# EAGLE design VoltageControl_V1p1 (EAGLE 9.6.2)
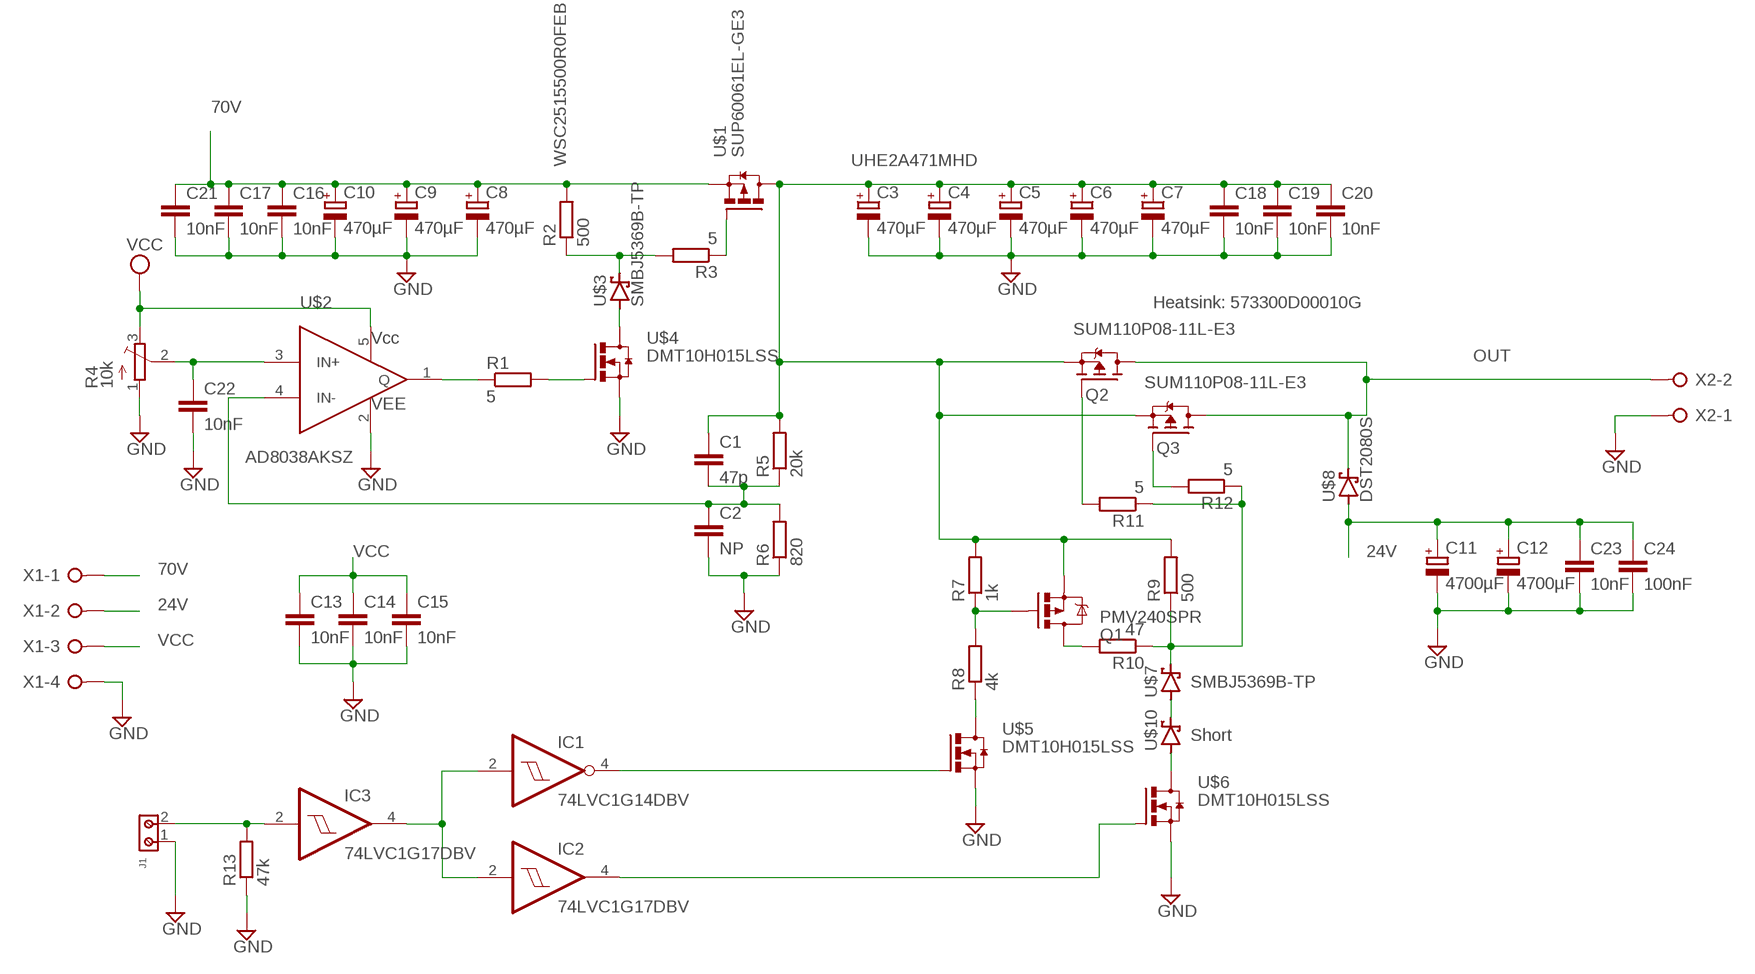
[diagram p0: schematic, sheet 1]

## Parts
C1  47p  C-EUC0805  [C0805]
C2  NP  C-EUC0805  [C0805]
C3  470µF  CPOL-EUE7.5-16  [E7,5-16]
C4  470µF  CPOL-EUE7.5-16  [E7,5-16]
C5  470µF  CPOL-EUE7.5-16  [E7,5-16]
C6  470µF  CPOL-EUE7.5-16  [E7,5-16]
C7  470µF  CPOL-EUE7.5-16  [E7,5-16]
C8  470µF  CPOL-EUE7.5-16  [E7,5-16]
C9  470µF  CPOL-EUE7.5-16  [E7,5-16]
C10  470µF  CPOL-EUE7.5-16  [E7,5-16]
C11  4700µF  CPOL-EUE7.5-18  [E7,5-18]
C12  4700µF  CPOL-EUE7.5-18  [E7,5-18]
C13  10nF  C-EUC0805  [C0805]
C14  10nF  C-EUC0805  [C0805]
C15  10nF  C-EUC0805  [C0805]
C16  10nF  C-EUC0805  [C0805]
C17  10nF  C-EUC0805  [C0805]
C18  10nF  C-EUC0805  [C0805]
C19  10nF  C-EUC0805  [C0805]
C20  10nF  C-EUC0805  [C0805]
C21  10nF  C-EUC0805  [C0805]
C22  10nF  C-EUC0805  [C0805]
C23  10nF  C-EUC1206  [C1206]
C24  100nF  C-EUC1206  [C1206]
IC1  74LVC1G14DBV  [SOT23-5]
IC2  74LVC1G17DBV  [SOT23-5]
IC3  74LVC1G17DBV  [SOT23-5]
J1  691210910002  [691210910002]
Q1  PMV240SPR  MOSFET-PCHANNEL  [SOT23-3]
Q2  SUM110P08-11L-E3  SPB80P06P  [TO263]
Q3  SUM110P08-11L-E3  SPB80P06P  [TO263]
R1  5  R-EU_R0805  [R0805]
R2  500  R-EU_R2512  [R2512]
R3  5  R-EU_R0805  [R0805]
R4  10k  TRIM_EU-SM-42/43X  [SM-42/43X]
R5  20k  R-EU_R0805  [R0805]
R6  820  R-EU_R0805  [R0805]
R7  1k  R-EU_R2512  [R2512]
R8  4k  R-EU_R2512  [R2512]
R9  500  R-EU_R2512  [R2512]
R10  47  R-EU_R0805  [R0805]
R11  5  R-EU_R0805  [R0805]
R12  5  R-EU_R0805  [R0805]
R13  47k  R-EU_R0805  [R0805]
U$1  SUP60061EL-GE3  MOSFET_SUNK  [TO220BH]
U$2  AD8038AKSZ  [SC70-5]
U$3  SMBJ5369B-TP  SCHOTTKYDO-214-AA  [DO-214AA]
U$4  DMT10H015LSS  [SOIC8]
U$5  DMT10H015LSS  [SOIC8]
U$6  DMT10H015LSS  [SOIC8]
U$7  SMBJ5369B-TP  SCHOTTKYDO-214-AA  [DO-214AA]
U$8  DST2080S  [TO-277B]
U$10  Short  SCHOTTKYDO-214-AA  [DO-214AA]
X1  W237-04P  [W237-4P]
X2  W237-02P  [W237-132]

## Nets
24V: C11.+ C12.+ C23.1 C24.1 U$8.P$2(A) U$8.P$3(A) X1.2
70V: C8.+ C9.+ C10.+ C16.1 C17.1 C21.1 R2.2 U$1.P$3(S) X1.1
GND: C2.2 C3.- C4.- C5.- C6.- C7.- C8.- C9.- C10.- C11.- C12.- C13.2 C14.2 C15.2 C16.2 C17.2 C18.2 C19.2 C20.2 C21.2 C22.2 C23.2 C24.2 J1.1 R4.1(A) R6.1 R13.1 U$2.2(VEE) U$4.1(S) U$4.2(S) U$4.3(S) U$5.1(S) U$5.2(S) U$5.3(S) U$6.1(S) U$6.2(S) U$6.3(S) X1.4 X2.1
N$1: R1.1 U$2.1(Q)
N$2: R1.2 U$4.4(G)
N$3: U$3.A U$4.5(D) U$4.6(D) U$4.7(D) U$4.8(D)
N$4: R2.1 R3.2 U$3.C
N$5: R3.1 U$1.P$1(G)
N$6: U$7.A U$10.C
N$7: C22.1 R4.2(S) U$2.3(IN+)
N$8: C1.2 C2.1 R5.1 R6.2 U$2.4(IN-)
N$9: Q1.1(G) R7.1 R8.2
N$10: C1.1 C3.+ C4.+ C5.+ C6.+ C7.+ C18.1 C19.1 C20.1 Q1.2(S) Q2.2(S) Q3.2(S) R5.2 R7.2 R9.2 U$1.P$2(D)
N$11: IC2.4(O) U$6.4(G)
N$12: R8.1 U$5.5(D) U$5.6(D) U$5.7(D) U$5.8(D)
N$13: U$6.5(D) U$6.6(D) U$6.7(D) U$6.8(D) U$10.A
N$14: R9.1 R10.1 R11.1 R12.1 U$7.C
N$15: Q1.3(D) R10.2
N$17: Q2.1(G) R11.2
N$18: Q3.1(G) R12.2
N$20: IC1.2(I) IC2.2(I) IC3.4(O)
N$21: IC1.4(O) U$5.4(G)
N$22: IC3.2(I) J1.2 R13.2
OUT: Q2.3(D) Q3.3(D) U$8.P$1(C) X2.2
VCC: C13.1 C14.1 C15.1 R4.3(E) U$2.5(VCC) X1.3

## Notes on the sheet
- WSC2515500R0FEB | UHE2A471MHD
- Heatsink: 573300D00010G

## Power pins joined to a net without a drawn wire
GND: IC1.3(GND) IC2.3(GND) IC3.3(GND)
VCC: IC1.5(VCC) IC2.5(VCC) IC3.5(VCC)

## Library data of the parts
C1 C2 C13-C24 = rcl:C-EU: CAPACITOR, European symbol; SPICEPREFIX: C
C3-C12 = rcl:CPOL-EU: POLARIZED CAPACITOR, European symbol; SPICEPREFIX: C
IC1 = 74xx-little-us:74*1G14: Single Schmitt-Trigger Inverter Gate
IC2 IC3 = 74xx-little-us:74*1G17: Single Schmitt-Trigger Buffer
J1 = Wurth_Connectors_WR-TBL Rising Cage Clamp:691210910002: WR-TBL Serie 2109 - 2.54 mm Horiz. Entry KIND PROPERTIES Pitch 2.54 mm MATERIAL PROPERTIES Insulator Material PA66 Insulator Flammability Rating UL94 V-0 Insulator Color Green Contact Material Brass Contact Plating Copper over Zinc Terminal Screw Material Steel Terminal Screw Plating Zinc Wire Guard Material Brass GENERAL INFORMATION Operating Temperature -40 up to +105 °C Compliance Lead free / RoHS ELECTRICAL PROPERTIES IR cULus 6 A Working Voltage [cULus] 150 V (AC) Withstanding Voltage [cULus] 1300 V (AC) Contact Resistance [cULus] 20 mΩ MECHANICAL PROPERTIES Wire Strip Length 4 up to 5 (mm) Screw M1.6 Solid Wire Section (AWG) 30 to 18 (AWG) Solid Wire Section (Metric) 0.0509 to 0.823 (mm²) Stranded Wire Section (AWG) 30 to 18 (AWG) Stranded Wire Section (Metric) 0.0509 to 0.823 (mm²) CERTIFICATION cULus Approval E315414 PACKAGING PROPERTIES Packaging Box <https://katalog.we-online.com/media/images/v2/o33231v209%20Family_WR-TBL_69121091000x.jpg> Details see: https://katalog.we-online.com/en/em/TBL_2_54_2109_HORIZONTAL_ENTRY_69121091000X Updated by Ella Wu 2019-11-12 2019(C) Wurth Elektronik; DATASHEET-URL: https://www.we-online.com/catalog/datasheet/691210910002.pdf; IR-UL: 6A; MOUNT: THT; PART-NUMBER: 691210910002; PINS: 2; PITCH: 2.54mm; TYPE: Horizontal; WIRE: 30 to 18 (AWG) 0.0509 to 0.823 (mm²); WORKING-VOLTAGE-UL: 150V (AC)
Q1 = User-Submitted:MOSFET-PCHANNEL: Generic PMOSFET IRLML2244 - TRANS-11153 (SOT-23 -20V -4.3A) (1.Gate 2.Source 3.Drain) FQP27P06 - COM-10349 <http://www.sparkfun.com/products/10349> (TO-220 -60V -27A) (1.Gate 2.Source 3.Drain); PROD_ID: TRANS-08285
Q2 Q3 = transistor-fet:SPB80P06P: SIPMOS (R) Power-Transistor P-Channel, Enhancement mode Source: http://www.infineon.com/upload/Document/cmc_upload/documents/011/3685/SPP80P06P.pdf
R1-R3 R5-R13 = rcl:R-EU_: RESISTOR, European symbol; SPICEPREFIX: R
R4 = pot:TRIM_EU-: POTENTIOMETER
U$1 = Orzada:MOSFET_SUNK
U$2 = Orzada:AD8038
U$3 U$7 U$10 = Orzada:SCHOTTKY
U$4-U$6 = Orzada:DMT10H015LSS
U$8 = Orzada:DST2080S: Schottky Diode TO-277B
X1 = con-wago-508:W237-04P: WAGO SREW CLAMP; OC_FARNELL: unknown; OC_NEWARK: unknown
X2 = con-wago-508:W237-02P: WAGO SREW CLAMP; OC_FARNELL: unknown; OC_NEWARK: unknown

## Board
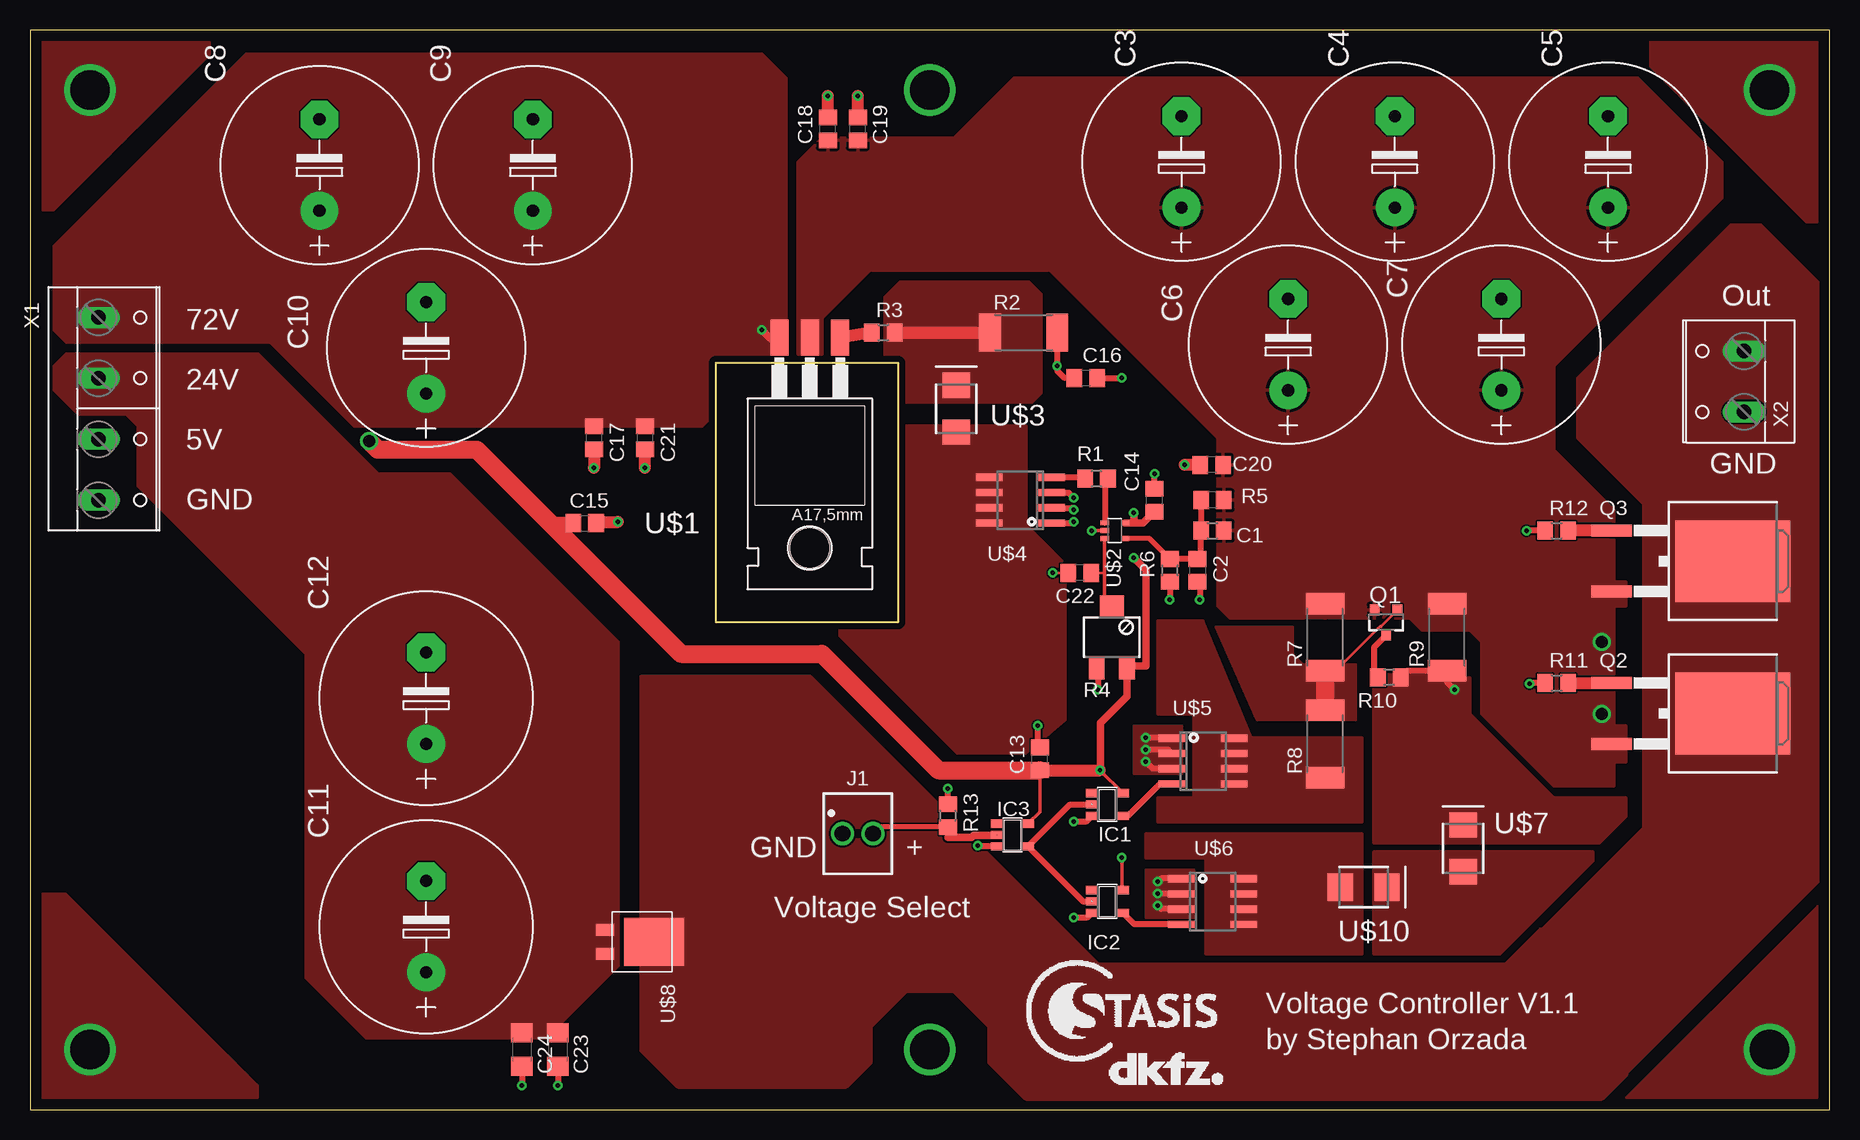
[diagram p1: board, top side]
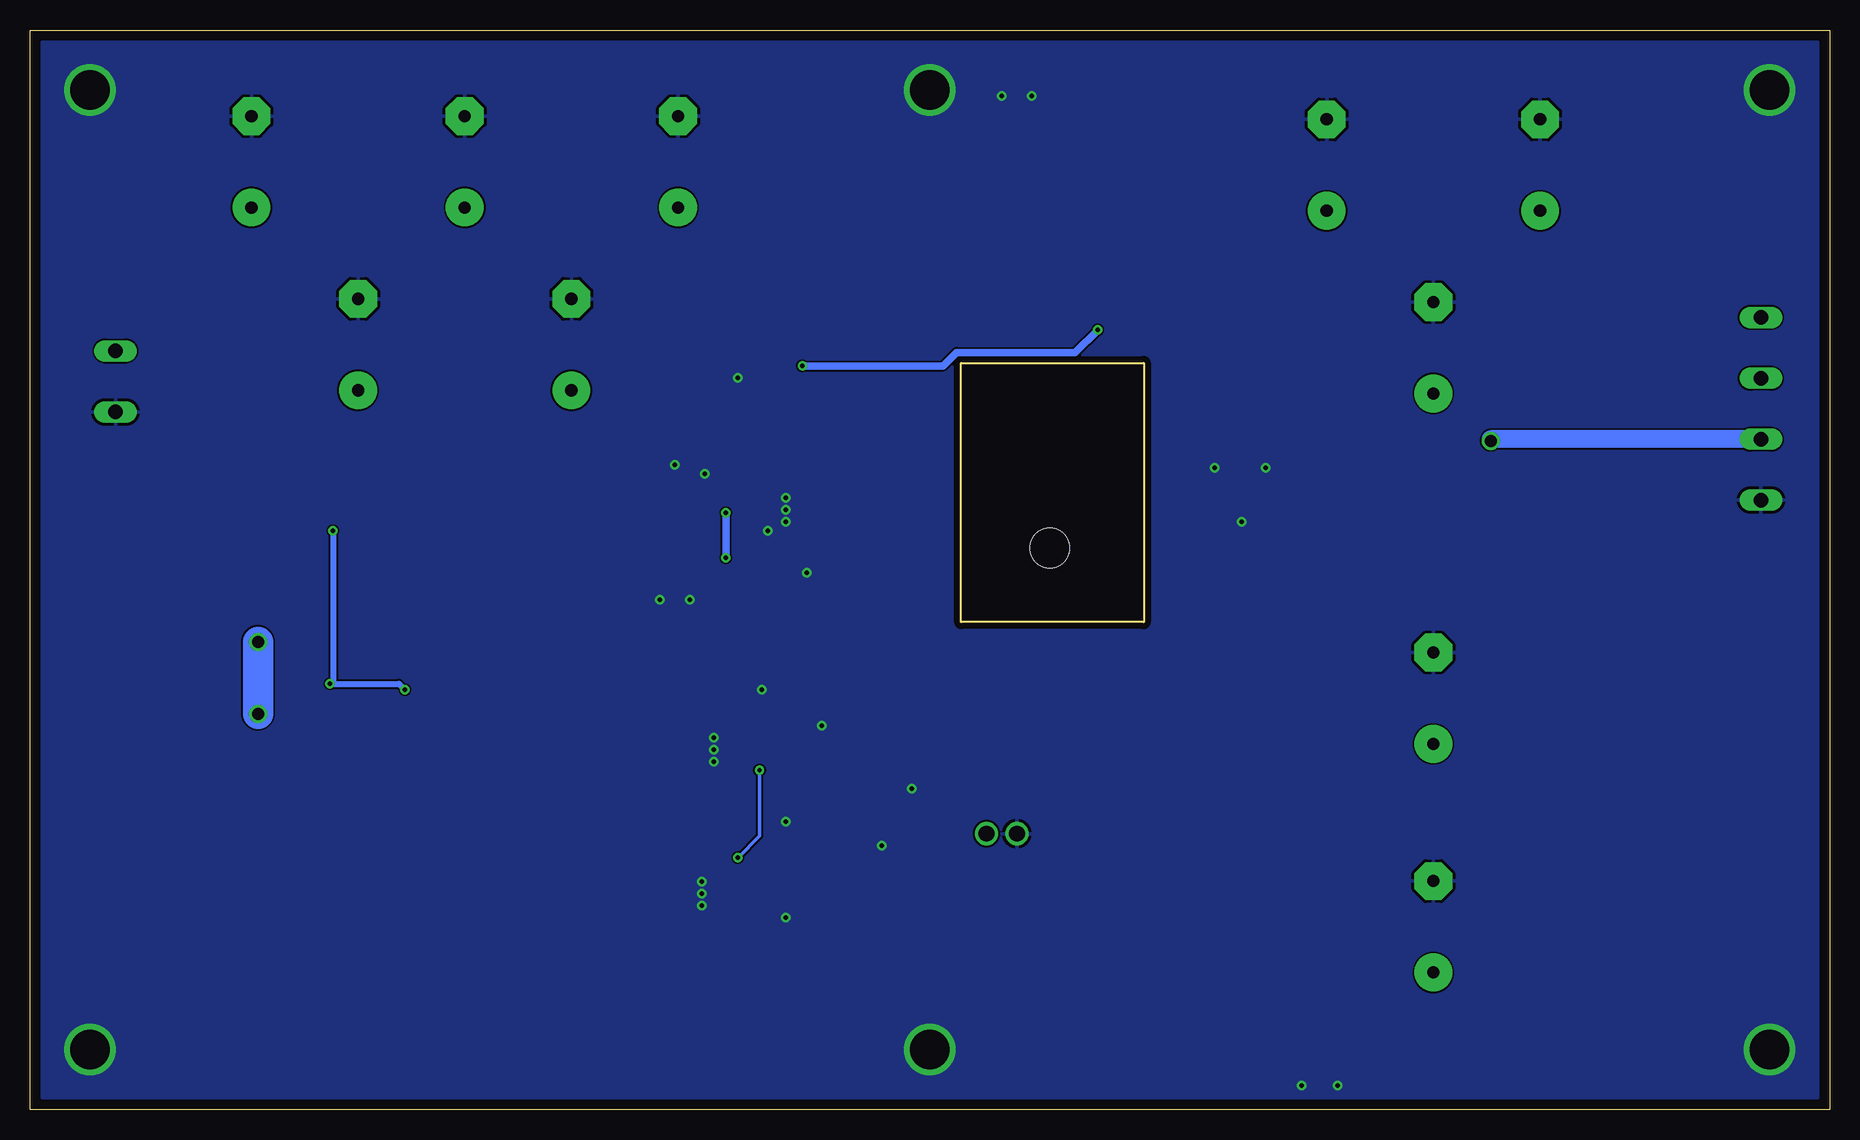
[diagram p2: board, bottom side, seen from below]

Size 150 x 90 mm. Coordinates in mm from the lower left corner, seen from the top.
Outline: 0,0 150,0 150,90 0,90 0,0
Outline: 57.15,62.23 57.15,40.64 72.39,40.64 72.39,62.23 57.15,62.23
Copper layers (1*16): Top 0.035mm / dielectric 1.5mm / Bottom 0.035mm
Design rules "default *": minimum track width 6mil, minimum drill 0.35mm, track to track 6mil, track to pad 6mil, pad to pad 6mil, via to via 6mil, smd to smd 6mil, copper to edge 20mil, drill to drill 6mil, minimum pad ring 10mil, minimum via ring 8mil, stop-mask expansion 4mil, vias tented up to drill 0mil, thermal gap 10mil

### Footprints (pad centres in the part's own frame; a part is rotated, then mirrored left to right if it is on the bottom)
C0805 = smd 1.3 x 1.5: 1 -0.95,0; 2 0.95,0
E7,5-16 = drill 1.016 pad 3.15: + -3.81,0 | drill 1.016 pad 3.15 octagon: - 3.81,0
E7,5-18 = drill 1.016 pad 3.15: + -3.81,0 | drill 1.016 pad 3.15 octagon: - 3.81,0
C1206 = smd 1.6 x 1.8: 1 -1.4,0; 2 1.4,0
SOT23-5 = smd 0.69 x 0.99: 1 -0.95,-1.29; 2 0,-1.29; 3 0.95,-1.29; 4 0.95,1.3; 5 -0.95,1.3
691210910002 = drill 1.3: 1 -1.27,0; 2 1.27,0
SOT23-3 = smd 0.8 x 0.9: 1 -0.95,-1; 2 0.95,-1; 3 0,1.1
TO263 = smd 1 x 3.4: 1 -2.54,-6.6; 2 2.54,-6.6 | smd 6.8 x 9.6: 3 0,3.5
R0805 = smd 1.3 x 1.5: 1 -0.95,0; 2 0.95,0
R2512 = smd 1.8 x 3.2: 1 -2.8,0; 2 2.8,0
SM-42/43X = smd 1.3 x 1.9: 1 -1.27,-2.55; 3 1.27,-2.55 | smd 2 x 1.9: 2 0,2.55
TO220BH = smd 1.5 x 3: P$1 -2.54,-6.35; P$2 0,-6.35; P$3 2.54,-6.35 | hole 3.302: 0,11.176
SC70-5 = smd 0.4 x 0.7: 1 -0.65,-0.85; 2 0,-0.85; 3 0.65,-0.85; 4 0.65,0.85; 5 -0.65,0.85
DO-214AA = smd 2.1 x 2.3: A -1.95,0; C 1.95,0
SOIC8 = smd 0.6 x 2.2: 1 -1.905,-2.6; 2 -0.635,-2.6; 3 0.635,-2.6; 4 1.905,-2.6; 5 1.905,2.6; 6 0.635,2.6; 7 -0.635,2.6; 8 -1.905,2.6
TO-277B = smd 4 x 5: P$1 0,2.5 | smd 1 x 1.5: P$2 -1,-1.6; P$3 1,-1.6
W237-4P = drill 1.194 long: 1 -7.62,-0.635; 2 -2.54,-0.635; 3 2.54,-0.635; 4 7.62,-0.635
W237-132 = drill 1.194 long: 1 -2.54,-0.635; 2 2.54,-0.635

### Placement (x,y rotation side)
C1  98.56,50.8 180 top
C2  97.31,44.95 270 top
C3  95.98,79.01 90 top
C4  113.76,79.01 90 top
C5  131.54,79.01 90 top
C6  104.87,63.77 90 top
C7  122.65,63.77 90 top
C8  24.13,78.74 90 top
C9  41.91,78.74 90 top
C10  33.02,63.5 90 top
C11  33.02,15.24 90 top
C12  33.02,34.29 90 top
C13  84.17,29.24 90 top
C14  93.73,50.8 90 top
C15  46.24,48.88 0 top
C16  88,61 0 top
C17  47,56 270 top
C18  66.5,81.75 90 top
C19  69,81.75 90 top
C20  98.5,53.75 180 top
C21  51.25,56 270 top
C22  87.5,44.75 180 top
C23  44,5 270 top
C24  41,5 270 top
IC1  89.79,25.43 270 top
IC2  89.79,17.35 270 top
IC3  81.9,22.89 270 top
J1  69,23 0 top
Q1  113.03,40.64 180 top
Q2  138.43,33.02 270 top
Q3  138.43,45.72 270 top
R1  88.9,52.59 180 top
R2  82.82,64.77 0 top
R3  71.12,64.77 0 top
R4  90.17,39.37 0 top
R5  98.56,48.26 0 top
R6  95.02,44.95 90 top
R7  107.95,39.37 90 top
R8  107.95,30.48 90 top
R9  118.11,39.37 90 top
R10  113.3,36.02 180 top
R11  127.25,35.56 0 top
R12  127.25,48.26 0 top
R13  76.5,24.5 270 top
U$1  65,58 180 top
U$2  90.42,48.26 270 top
U$3  77.2,58.42 90 top
U$4  82.55,50.8 90 top
U$5  97.78,29.05 270 top
U$6  98.57,17.35 270 top
U$7  119.46,21.78 90 top
U$8  49.53,13.97 270 top
U$10  111.16,18.54 0 top
U$11  [LOGO_STASIS]  92,8 0 top
U$12  [LOGO_DKFZ]  90,2 0 top
X1  6.35,58.42 270 top
X2  142.24,60.7 90 top

### Tracks (layer width: path | path; a pad name or v marks a point on that pad's centre or on a via)
24V
  pour Top (no thermals): 3,63 2,62 2,60 4,58 8,58 9,57 9,52 23,38 23,11 28,6 43,6 49,12 49,39 35,53 29,53 19,63
70V  (via drill 0.35)
  Top 0.508: R2.2 v85.62,62 85.62,61.62 86.24,61 C16.1 | 61.73,64.27 U$1.P$3
  Top 0.61: v61,65 61.73,64.27
  Bottom 0.61: v61,65 62.88,63.12 72.76,63.12 73.88,62 v85.62,62
  pour Top (no thermals): 20,64 3,64 2,65 2,72 18,88 61,88 63,86 63,63 62,63 56,57 27,57
GND  (via drill 0.35, 3.3)
  Top 0.2: C22.2 v85.25,44.75
  Top 0.305: U$2.2 v88.51,48.26 v88.5,48.25
  Top 0.508: R4.1 89,36.72 v89,35 | IC1.3 88.02,24 v87,24 | IC2.3 88.1,16 v87,16 | IC3.3 79.06,21.94 v79,22 | U$6.1 94.25,19.25 v94,19 | U$6.2 94.02,17.98 v94,18 | U$6.3 94.28,16.71 v94,17 | U$5.3 93.58,28.41 v93,29 | U$5.2 94.86,30 v93,30 | U$5.1 95.14,31 v93,31 | C13.2 84,30.36 v84,32 | R6.1 95,43.98 v95,42.5 | C2.2 97.5,43.81 v97.5,42.5 | C14.2 93.73,52.98 v93.75,53 | C16.2 v91,61 | U$4.3 86.56,51.44 v87,51 | U$4.2 86.83,50.16 v87,50 | U$4.1 86.89,48.9 v87,49 | R13.1 v76.5,26.75 | C24.2 v41,2 | C23.2 v44,2
  Top 1.016: C20.2 v96.25,53.75 | C19.2 v69,84.5 | C18.2 v66.5,84.5 | C17.2 v47,53.5 | v51.25,53.5 C21.2 | C15.2 47.31,49 v49,49
  other vias: 5,85 5,5 145,5 145,85 75,5 75,85
  pour Bottom: 1,89 1,2 1,1 149,1 149,89
  pour Top (rank 2, no thermals): 97,20 97,16 93,16 93,20
  pour Top (rank 2, no thermals): 96,32 92,32 92,28 96,28
  pour Top: 1,89 1,75 2,75 15,88 15,89
  pour Top: 1,18 1,1 19,1 19,2 3,18
  pour Top: 149,17 133,1 149,1
  pour Top: 135,89 135,87 148,74 149,74 149,89
N$1
  Top 0.508: R1.1 89.6,52.34 89.6,48.94 U$2.1
N$2
  Top 0.508: R1.2 87.83,52.7 U$4.4
N$3
  pour Top (no thermals): 67.5,57 67.5,39.5 77.25,29.75 83,29.75 86.25,32.5 86.25,45.5 83,48.75 83,57
N$4
  Top 1.016: R3.2 77,64.77 R2.1 | U$3.C 77,60.57
  pour Top (no thermals): 71.25,59 83.5,59 84.25,59.75 84.25,68 83.25,69 72.5,69 71.25,67.75
N$5
  Top 1.016: R3.1 U$1.P$1
N$6
  pour Top (rank 2, no thermals): 112,21.5 112,13 122.5,13 130.25,20.75 130.25,21.5
N$7
  Top 0.2: C22.1 89.57,44.75
  Top 0.305: R4.2 89.57,42.52 89.57,44.75 U$2.3
N$8
  Top 0.406: R6.2 93.31,47.61 U$2.4
  Top 0.508: R6.2 C2.1 97.61,46.2 R5.1 C1.2
N$9
  Top 0.254: Q1.1 112.61,40.27 112.51,40.27 108.81,36.57 R7.1
  Top 1.5: R7.1 R8.2
  pour Top (no thermals): 110.5,37.11 106.14,37.11 105.25,38 105.25,40.25 98.87,40.25 102.25,32.5 110.5,32.5
N$10  (via drill 1)
  Bottom 2.54: v131,33 v131,39
  pour Top (rank 2): 64,63 64,79 66,81 77,81 82,86 134,86 141,79 141,76 127,62 127,55 132,50 132,27 127,27 121,33 121,39 120,40 116,40 115,41 100,41 99,42 99,56 85,70 70,70 66,66 66,63
  pour Top (no thermals): 64,67 64,63 66,63 66,67
  pour Top (no thermals): 129,44 129,42 133,42 133,44
  pour Top (no thermals): 129,32 129,29 133,29 133,32
  pour Top (rank 2, no thermals): 105.5,41 110.25,41 110.25,43.5 105.5,43.5
  pour Top (rank 2, no thermals): 115.75,43.5 115.75,40.75 120.5,40.75 120.5,43.5
N$11
  Top 0.508: U$6.4 92.05,15.45 IC2.4
N$12
  pour Top (rank 2, no thermals): 94,40.75 94,33 97,33 97,26 94,26 94,24 111,24 111,31 101.75,31 97.73,40.73 97.75,40.75
N$13
  pour Top (rank 2, no thermals): 111,23 93,23 93,21 98,21 98,13 111,13
N$14  (via drill 0.35)
  Top 0.508: R10.1 114.8,36.57 R9.1 118.11,35.64 v118.75,35 | R11.1 125.06,35.56 v125,35.5 | R12.1 v124.76,48.26 v124.75,48.25
  Bottom 0.508: v118.75,35 119.25,35.5 v125,35.5 124.75,35.75 v124.75,48.25
  pour Top (no thermals): 112,36.25 112,22.25 130.82,22.25 133,24.43 133,26 127.03,26 120,33 120,36 116.72,36 116.47,36.25
N$15
  Top 0.305: R10.2 112.35,36.38 112.03,36.7
  Top 0.508: Q1.3 112.03,38.54 112.03,36.7
N$17
  Top 1.016: R11.2 Q2.1
N$18
  Top 1.016: Q3.1 R12.2
N$20
  Top 0.508: IC1.2 86.69,25.43 IC3.4 87.79,17.35 IC2.2
N$21
  Top 0.508: U$5.4 94.18,27.14 91.52,24.48 IC1.4
N$22
  Top 0.305: R13.2 76.5,22.67
  Top 0.406: R13.2 70.82,23.55 J1.2
  Top 0.61: 76.5,22.67 78.49,22.67 78.65,22.84 80.56,22.84 IC3.2
OUT
  pour Top (no thermals): 141.75,73.75 129,61 129,56 134.5,50.5 134.5,23.5 120,9 127,2 132,2 149,19 149,69 144.25,73.75
  pour Top (rank 2, no thermals): 51,36 51,5 54,2 68,2 70,4 70,7 73,10 77,10 80,7 80,4 83,1 131,1 133,3 133,8 126,15 123,12 89,12 65,36
VCC  (via drill 0.35, 1)
  Top 0.305: C13.1 84.17,24.81 IC3.5 | IC1.5 89.23,28.23 v89.18,28.29 | v91,21 91,18.39 IC2.5
  Top 0.61: 89.23,28.23 89.23,32.23 91.44,34.44 R4.3 91.62,37 93,37 93,45 v92,46 | C14.1 92.79,48.91 92,48.91 | 92,48.91 U$2.5 | v92,49.75 92,48.91
  Top 1.016: C13.1 v89.18,28.29 | C15.1 43.37,48.88 43.12,49.12
  Top 1.5: v28.25,55.75 29,55 37.25,55 43.12,49.12 54.25,38 66,38 75.71,28.29 C13.1
  Bottom 0.305: v89.18,28.29 89.18,22.82 v91,21
  Bottom 0.61: v92,46 v92,49.75
  Bottom 1.5: X1.3 28.25,55.88 v28.25,55.75

### Text on the board
tPlace: Out | 72V | 24V | U$3 | 5V | GND | GND | U$7 | GND | + | Voltage Select | U$10 | Voltage Controller V1.1 | by Stephan Orzada